# Altium project OLED_0.96.PrjPcb
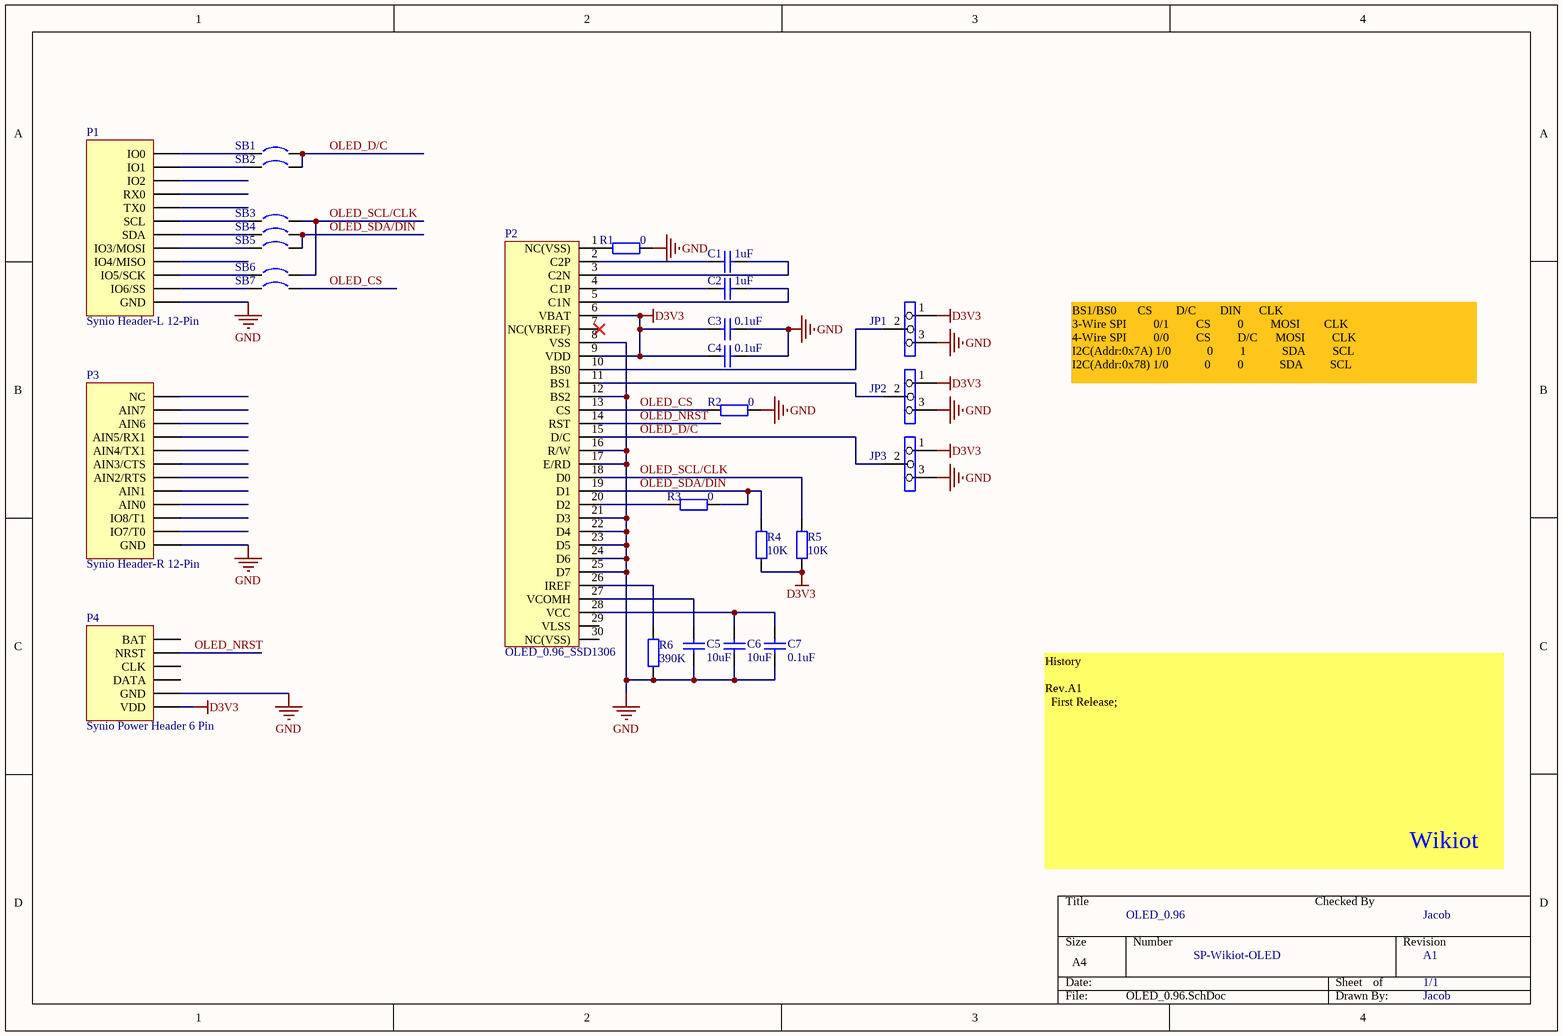
[diagram p0: OLED_0.96.SchDoc]
1 sheet, 28 parts. Net scope: global (net labels, ports and power ports of the same name join across sheets).
Board file: OLED_0.96.PcbDoc

## Sheet OLED_0.96.SchDoc
size A4

### Parts
*  LOGO  [Logo]  (value not drawn)
C1  1uF  [0603C]
C2  1uF  [0603C]
C3  0.1uF  [0603C]
C4  0.1uF  [0603C]
C5  10uF  [0603C]
C6  10uF  [0603C]
C7  0.1uF  [0603C]
JP1  JP3  [JUMPER3_SMD]  (value not drawn)
JP2  JP3  [JUMPER3_SMD]  (value not drawn)
JP3  JP3  [JUMPER3_SMD]  (value not drawn)
P1  Synio Header-L 12-Pin  [HDR1X12/2.54MM]
P2  OLED_0.96_SSD1306  [OLED_0.96_SSD1306]
P3  Synio Header-R 12-Pin  [HDR1X12/2.54MM]
P4  Synio Power Header 6 Pin  [HDR1X6/2.54MM]
R1  0  [0603R]
R2  0  [0603R]
R3  0  [0603R]
R4  10K  [0603R]
R5  10K  [0603R]
R6  390K  [0603R]
SB1  Circuit Breaker  [JP2_SMD]  (value not drawn)
SB2  Circuit Breaker  [JP2_SMD]  (value not drawn)
SB3  Circuit Breaker  [JP2_SMD]  (value not drawn)
SB4  Circuit Breaker  [JP2_SMD]  (value not drawn)
SB5  Circuit Breaker  [JP2_SMD]  (value not drawn)
SB6  Circuit Breaker  [JP2_SMD]  (value not drawn)
SB7  Circuit Breaker  [JP2_SMD]  (value not drawn)

### Nets
D3V3: C3.1 C4.2 JP1.1 JP2.1 JP3.1 P2.6(VBAT) P2.9(VDD) P4.1(VDD) R4.1 R5.1
GND: C3.2 C4.1 C5.2 C6.2 C7.2 JP1.3 JP2.3 JP3.3 P1.1(GND) P2.8(VSS) P2.12(BS2) P2.16(R/W) P2.17(E/RD) P2.21(D3) P2.22(D4) P2.23(D5) P2.24(D6) P2.25(D7) P3.1(GND) P4.2(GND) R1.2 R2.2 R6.1
OLED_CS: P2.13(CS) R2.1 SB7.2
OLED_D/C: JP3.2 P2.15(D/C) SB1.2 SB2.2
OLED_NRST: P2.14(RST) P4.5(NRST)
OLED_SCL/CLK: P2.18(D0) R5.2 SB3.2 SB6.2
OLED_SDA/DIN: P2.19(D1) R3.2 R4.2 SB4.2 SB5.2
NetC1_1: C1.1 P2.2(C2P)
NetC1_2: C1.2 P2.3(C2N)
NetC2_1: C2.1 P2.4(C1P)
NetC2_2: C2.2 P2.5(C1N)
NetC5_1: C5.1 P2.27(VCOMH)
NetC6_1: C6.1 C7.1 P2.28(VCC)
NetJP1_2: JP1.2 P2.10(BS0)
NetJP2_2: JP2.2 P2.11(BS1)
NetP1_2: P1.2(IO6/SS) SB7.1
NetP1_3: P1.3(IO5/SCK) SB6.1
NetP1_5: P1.5(IO3/MOSI) SB5.1
NetP1_6: P1.6(SDA) SB4.1
NetP1_7: P1.7(SCL) SB3.1
NetP1_11: P1.11(IO1) SB2.1
NetP1_12: P1.12(IO0) SB1.1
NetP2_1: P2.1(NC(VSS)) R1.1
NetP2_20: P2.20(D2) R3.1
NetP2_26: P2.26(IREF) R6.2

Not connected (* = marked no-connect by the designer): P1 4(IO4/MISO) 8(TX0) 9(RX0) 10(IO2); P2 7(NC(VBREF))* 29(VLSS) 30(NC(VSS)); P3 2(IO7/T0) 3(IO8/T1) 4(AIN0) 5(AIN1) 6(AIN2/RTS) 7(AIN3/CTS) 8(AIN4/TX1) 9(AIN5/RX1) 10(AIN6) 11(AIN7) 12(NC); P4 3(DATA) 4(CLK) 6(BAT)

### Notes on the sheet
- BS1/BS0       CS        D/C        DIN	     CLK
  3-Wire SPI        	0/1         CS         0	        MOSI        CLK
  4-Wire SPI        	0/0         CS         D/C      MOSI         CLK
  I2C(Addr:0x7A)	1/0            0         1            SDA         SCL
  I2C(Addr:0x78)	1/0            0         0            SDA         SCL
- (near *) History
  Rev.A1
  First Release;
- OLED_0.96
- (near *) Checked By
- Jacob
- SP-Wikiot-OLED
- A1
- 1/1
- (in symbol LOGO) Wikiot

### Library data of the parts
C1-C7 = Cap: Capacitor; Published: 8-Jun-2000; LatestRevisionDate: 17-Jul-2002; LatestRevisionNote: Re-released for DXP Platform.; PackageReference: RAD-0.3
  C1 C2: Value: 1uF
  C3 C4 C7: Value: 0.1uF
  C5 C6: Value: 10uF
P1 = Synio Header-L 12-Pin: Synio Header-L, 12-Pin; LatestRevisionDate: 17-Jul-2002; LatestRevisionNote: Re-released for DXP Platform.; Publisher: Altium Limited
P3 = Synio Header-R 12-Pin: Synio Header-R, 12-Pin; LatestRevisionDate: 17-Jul-2002; LatestRevisionNote: Re-released for DXP Platform.; Publisher: Altium Limited
R1-R6 = Res: Resistor; Published: 8-Jun-2000; LatestRevisionDate: 17-Jul-2002; LatestRevisionNote: Re-released for DXP Platform.; PackageReference: AXIAL-0.4; Publisher: Altium Limited
  R1-R3: Value: 0
  R4 R5: Value: 10K
  R6: Value: 390K
SB1-SB7 = Circuit Breaker: Solder: YES; Published: 24-Mar-1999; Revision: July-2002: Re-released for DXP Platform.; Publisher: Altium Limited